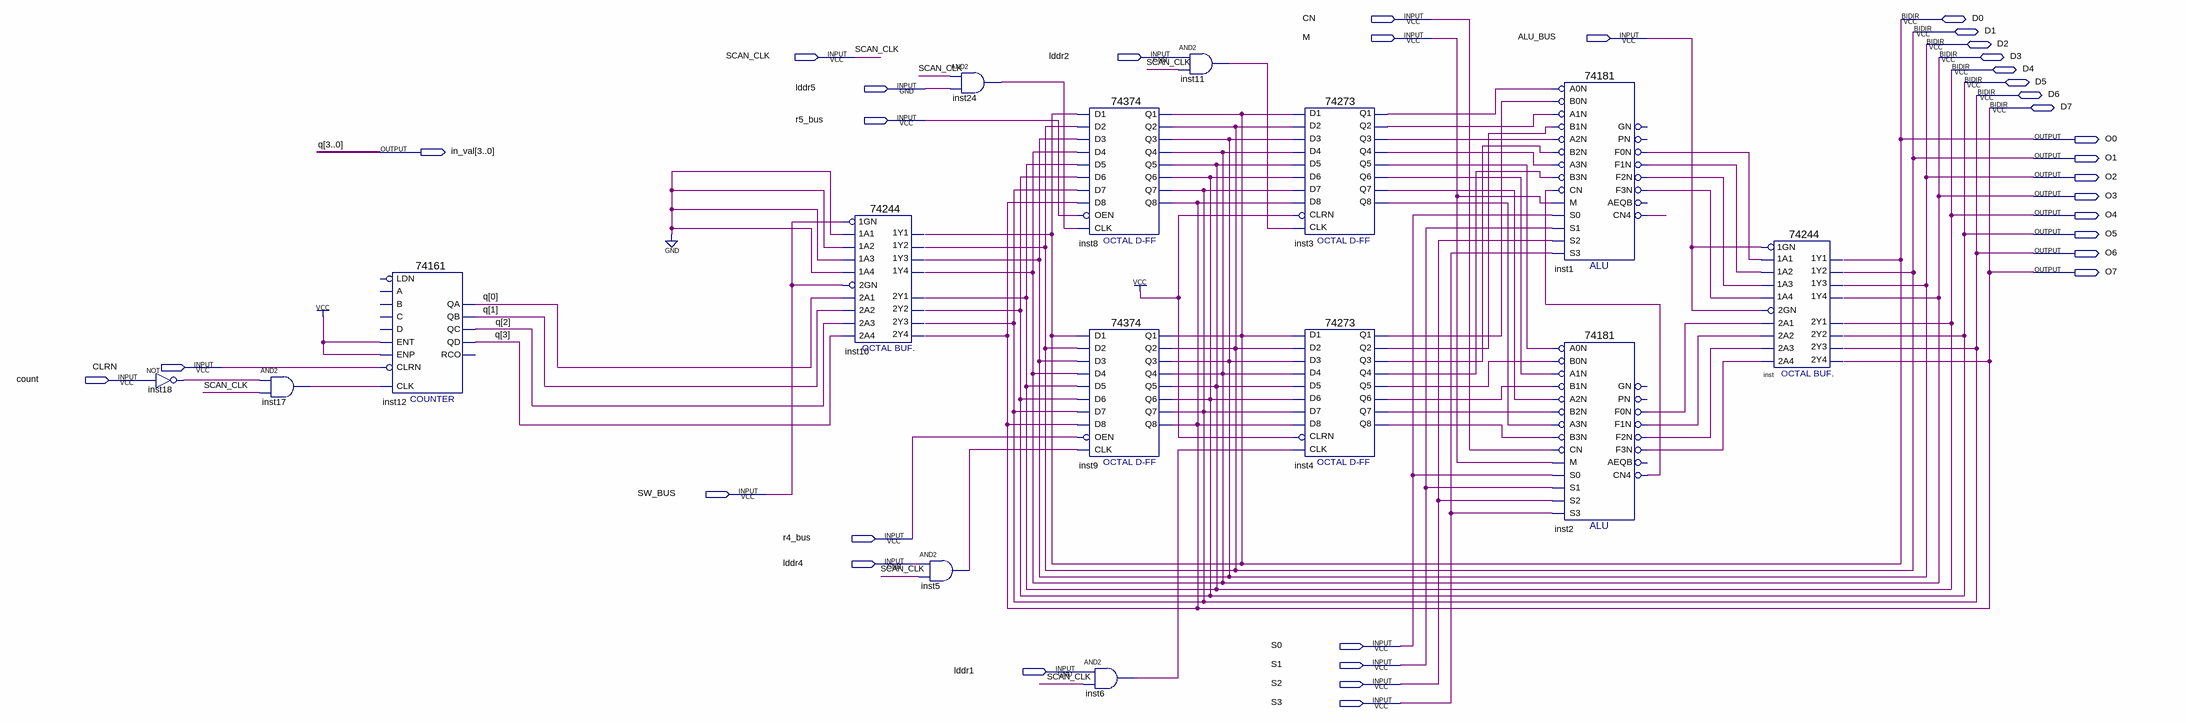
[diagram p0: schematic sheet]
// Quartus schematic exp_r_alu.bdf as structural Verilog: 15 symbols, 34 pins
module exp_r_alu (
  input  CN,
  input  M,
  input  ALU_BUS,
  input  SCAN_CLK,
  input  lddr2,
  input  lddr5,
  input  r5_bus,
  input  CLRN,
  input  count,
  input  SW_BUS,
  input  r4_bus,
  input  lddr4,
  input  S0,
  input  S1,
  input  lddr1,
  input  S2,
  input  S3,
  inout  D0,
  inout  D1,
  inout  D2,
  inout  D3,
  inout  D4,
  inout  D5,
  inout  D6,
  inout  D7,
  output O0,
  output [3:0] in_val,
  output O1,
  output O2,
  output O3,
  output O4,
  output O5,
  output O6,
  output O7
);

  wire inst1_cn4, inst1_f0n, inst1_f1n, inst1_f2n, inst1_f3n, inst2_cn4, inst2_f0n, inst2_f1n, inst2_f2n,
       inst2_f3n, inst3_q1, inst3_q2, inst3_q3, inst3_q4, inst3_q5, inst3_q6, inst3_q7, inst3_q8, inst4_q1,
       inst4_q2, inst4_q3, inst4_q4, inst4_q5, inst4_q6, inst4_q7, inst4_q8, inst5_out, inst6_out,
       inst11_out, inst17_out, inst18_out, inst24_out;

  not inst18 (inst18_out, count);
  and inst17 (inst17_out, inst18_out, SCAN_CLK);
  \74161  inst12 (
    .CLRN(CLRN), .CLK(inst17_out), .ENP(1'b1), .ENT(1'b1), .QD(in_val[3]), .QC(in_val[2]), .QB(in_val[1]),
    .QA(in_val[0]));  // open: LDN, A, D, B, C, RCO
  \74244  inst10 (
    .\1A2 (1'b0), .\1A4 (1'b0), .\1A1 (1'b0), .\1A3 (1'b0), .\1GN (SW_BUS), .\2A3 (in_val[2]),
    .\2GN (SW_BUS), .\2A1 (in_val[0]), .\2A4 (in_val[3]), .\2A2 (in_val[1]), .\1Y2 (D1), .\1Y4 (D3),
    .\2Y1 (D4), .\1Y1 (D0), .\2Y3 (D6), .\2Y4 (D7), .\1Y3 (D2), .\2Y2 (D5));
  and inst5 (inst5_out, lddr4, SCAN_CLK);
  and inst24 (inst24_out, SCAN_CLK, lddr5);
  \74374  inst8 (
    .D1(D0), .D2(D1), .D3(D2), .D4(D3), .D6(D5), .D5(D4), .OEN(r5_bus), .D8(D7), .D7(D6), .CLK(inst24_out),
    .Q2(D1), .Q3(D2), .Q5(D4), .Q4(D3), .Q6(D5), .Q7(D6), .Q8(D7), .Q1(D0));
  \74374  inst9 (
    .D1(D0), .D2(D1), .D3(D2), .D4(D3), .D6(D5), .D5(D4), .OEN(r4_bus), .D8(D7), .D7(D6), .CLK(inst5_out),
    .Q2(D1), .Q3(D2), .Q5(D4), .Q4(D3), .Q6(D5), .Q7(D6), .Q8(D7), .Q1(D0));
  and inst6 (inst6_out, lddr1, SCAN_CLK);
  and inst11 (inst11_out, lddr2, SCAN_CLK);
  \74273  inst3 (
    .D2(D1), .D3(D2), .D1(D0), .D4(D3), .D7(D6), .D6(D5), .D5(D4), .D8(D7), .CLK(inst11_out), .CLRN(1'b1),
    .Q4(inst3_q4), .Q1(inst3_q1), .Q2(inst3_q2), .Q3(inst3_q3), .Q6(inst3_q6), .Q5(inst3_q5), .Q7(inst3_q7),
    .Q8(inst3_q8));
  \74273  inst4 (
    .D2(D1), .D3(D2), .D1(D0), .D4(D3), .D7(D6), .D6(D5), .D5(D4), .D8(D7), .CLK(inst6_out), .CLRN(1'b1),
    .Q4(inst4_q4), .Q1(inst4_q1), .Q2(inst4_q2), .Q3(inst4_q3), .Q6(inst4_q6), .Q5(inst4_q5), .Q7(inst4_q7),
    .Q8(inst4_q8));
  \74181  inst1 (
    .B0N(inst4_q1), .A0N(inst3_q1), .A1N(inst3_q2), .B1N(inst4_q2), .A3N(inst3_q4), .B2N(inst4_q3),
    .A2N(inst3_q3), .M(M), .CN(inst2_cn4), .B3N(inst4_q4), .S2(S2), .S1(S1), .S0(S0), .S3(S3),
    .F3N(inst1_f3n), .F1N(inst1_f1n), .F0N(inst1_f0n), .CN4(inst1_cn4), .F2N(inst1_f2n));  // open: PN, GN, AEQB
  \74181  inst2 (
    .B0N(inst4_q5), .A0N(inst3_q5), .A1N(inst3_q6), .B1N(inst4_q6), .A3N(inst3_q8), .B2N(inst4_q7),
    .A2N(inst3_q7), .M(M), .CN(CN), .B3N(inst4_q8), .S2(S2), .S1(S1), .S0(S0), .S3(S3), .F3N(inst2_f3n),
    .F1N(inst2_f1n), .F0N(inst2_f0n), .CN4(inst2_cn4), .F2N(inst2_f2n));  // open: PN, GN, AEQB
  \74244  inst (
    .\1A2 (inst1_f1n), .\1A4 (inst1_f3n), .\1A1 (inst1_f0n), .\1A3 (inst1_f2n), .\1GN (ALU_BUS),
    .\2A3 (inst2_f2n), .\2GN (ALU_BUS), .\2A1 (inst2_f0n), .\2A4 (inst2_f3n), .\2A2 (inst2_f1n), .\1Y2 (D1),
    .\1Y4 (D3), .\2Y1 (D4), .\1Y1 (D0), .\2Y3 (D6), .\2Y4 (D7), .\1Y3 (D2), .\2Y2 (D5));

  assign O0 = D0;
  assign O1 = D1;
  assign O2 = D2;
  assign O3 = D3;
  assign O4 = D4;
  assign O5 = D5;
  assign O6 = D6;
  assign O7 = D7;

  // Other names for the same wires on the sheet: q[3:0] = in_val
endmodule
